# EAGLE design rfid_ctl3_v2 (EAGLE 7.5.0)
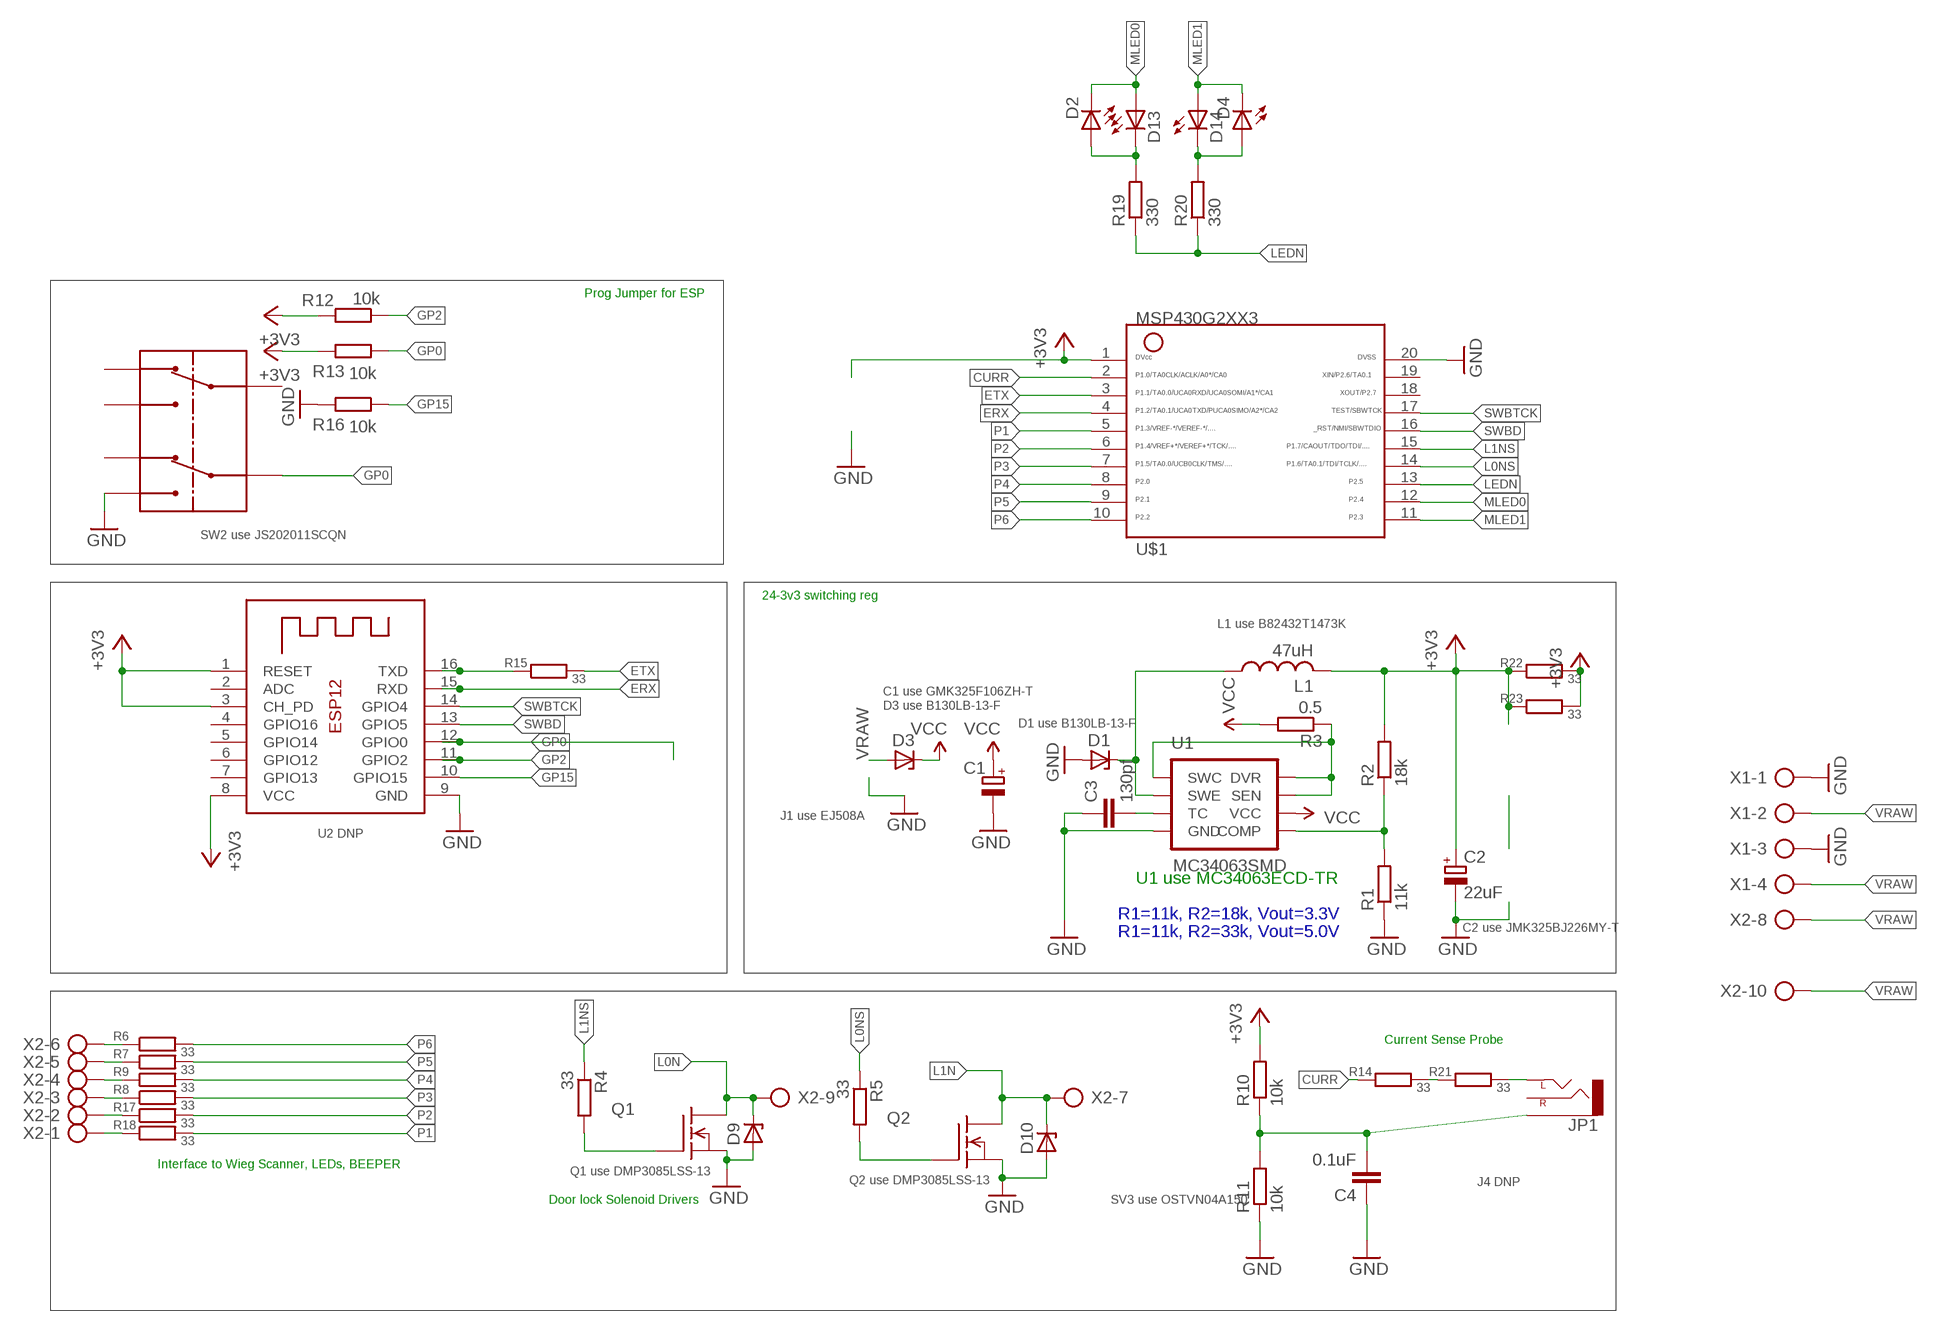
[diagram p0: schematic, sheet 1]

## Parts
C1  CPOL-EUE2.5-7  [E2,5-7]
C2  22uF  CPOL-EUE2.5-7  [E2,5-7]
C3  130pf  C-EUC1206  [C1206]
C4  0.1uF  C-EUC1206  [C1206]
D1  ZENER-DIODESMB  [SMB]
D2  LED5MM  [LED5MM]
D3  ZENER-DIODESMB  [SMB]
D4  LED5MM  [LED5MM]
D9  ZENER-DIODESMB  [SMB]
D10  ZENER-DIODESMB  [SMB]
D13  LED5MM  [LED5MM]
D14  LED5MM  [LED5MM]
JP1  AUDIO-JACKSMD2  [AUDIO-JACK-3.5MM-SMD]
L1  47uH  L-USL1812  [L1812]
Q1  FDS5680  [SO-8]
Q2  FDS5680  [SO-8]
R1  11k  R-EU_R1206  [R1206]
R2  18k  R-EU_R1206  [R1206]
R3  0.5  R-EU_R1206  [R1206]
R4  33  R-EU_R1206  [R1206]
R5  33  R-EU_R1206  [R1206]
R6  33  R-EU_R1206  [R1206]
R7  33  R-EU_R1206  [R1206]
R8  33  R-EU_R1206  [R1206]
R9  33  R-EU_R1206  [R1206]
R10  10k  R-EU_R1206  [R1206]
R11  10k  R-EU_R1206  [R1206]
R12  10k  R-EU_R1206  [R1206]
R13  10k  R-EU_R1206  [R1206]
R14  33  R-EU_R1206  [R1206]
R15  33  R-EU_R1206  [R1206]
R16  10k  R-EU_R1206  [R1206]
R17  33  R-EU_R1206  [R1206]
R18  33  R-EU_R1206  [R1206]
R19  330  R-EU_R1206  [R1206]
R20  330  R-EU_R1206  [R1206]
R21  33  R-EU_R1206  [R1206]
R22  33  R-EU_R6332  [R6332]
R23  33  R-EU_R6332  [R6332]
SW2  L202011MS02Q  [SMT]
U1  MC34063SMD  [SO08]
U2  ESP-12  [ESP-12]
U$1  G2XX3---N20  [N20]
X1  AK300/4  [AK300/4]
X2  AK300/10  [AK300/10]

## Nets
+3V3: C2.+ L1.2 R2.2 R10.2 R12.2 R13.2 R22.1 R22.2 R23.1 R23.2 U2.1(RESET) U2.3(CH_PD) U2.8(VCC) U$1.1
CURR: R14.1 U$1.2
ERX: U2.15(RXD) U$1.4
ETX: R15.2 U$1.3
GND: C1.- C2.- C3.1 C4.1 D1.A D9.A D10.A Q1.1(S) Q1.2(S) Q1.3(S) Q2.1(S) Q2.2(S) Q2.3(S) R1.1 R11.1 R16.2 SW2.B1 U1.4(GND) U2.9(GND) U$1.20 X1.1 X1.3
GP0: R13.1 SW2.B U2.12(GPIO0)
GP2: R12.1 U2.11(GPIO2)
GP15: R16.1 U2.10(GPIO15)
L0N: D9.C Q1.5(D) Q1.6(D) Q1.7(D) Q1.8(D) X2.9
L0NS: R5.1 U$1.14
L1N: D10.C Q2.5(D) Q2.6(D) Q2.7(D) Q2.8(D) X2.7
L1NS: R4.1 U$1.15
LEDN: R19.1 R20.1 U$1.13
MLED0: D2.K(C) D13.A U$1.12
MLED1: D4.K(C) D14.A U$1.11
N$1: Q1.4(G) R4.2
N$2: C3.2 U1.3(TC)
N$3: D1.C L1.1 U1.2(SWE)
N$4: Q2.4(G) R5.2
N$5: R1.2 R2.1 U1.5(COMP)
N$6: R3.1 U1.1(SWC) U1.7(SEN) U1.8(DVR)
N$7: R14.2 R21.1
N$8: R6.1 X2.6
N$9: R7.1 X2.5
N$10: R8.1 X2.4
N$11: R9.1 X2.3
N$12: C4.2 JP1.SLEEVE R10.1 R11.2
N$14: JP1.TIP(LEFT) R21.2
N$15: D2.A D13.K(C) R19.2
N$16: D4.A D14.K(C) R20.2
N$17: R17.1 X2.2
N$18: R18.1 X2.1
N$55: R15.1 U2.16(TXD)
P1: R18.2 U$1.5
P2: R17.2 U$1.6
P3: R9.2 U$1.7
P4: R8.2 U$1.8
P5: R7.2 U$1.9
P6: R6.2 U$1.10
SWBD: U2.13(GPIO5) U$1.16
SWBTCK: U2.14(GPIO4) U$1.17
VCC: C1.+ D3.C R3.2 U1.6(VCC)
VRAW: D3.A X1.2 X1.4 X2.8 X2.10
Unconnected: JP1.RING(RIGHT) SW2.A SW2.A1 SW2.A2 SW2.B2 U2.2(ADC) U2.4(GPIO16) U2.5(GPIO14) U2.6(GPIO12) U2.7(GPIO13) U$1.18 U$1.19

## Notes on the sheet
- Prog Jumper for ESP
- SW2 use JS202011SCQN
- 24-3v3 switching reg
- L1 use B82432T1473K
- C1 use GMK325F106ZH-T
- D3 use B130LB-13-F
- D1 use B130LB-13-F
- J1 use EJ508A
- U2 DNP
- U1 use MC34063ECD-TR
- R1=11k, R2=18k, Vout=3.3V
- C2 use JMK325BJ226MY-T
- R1=11k, R2=33k, Vout=5.0V
- Current Sense Probe
- Interface to Wieg Scanner, LEDs, BEEPER
- Q1 use DMP3085LSS-13
- Q2 use DMP3085LSS-13 | J4 DNP
- Door lock Solenoid Drivers | SV3 use OSTVN04A150

## Library data of the parts
C1 C2 = rcl:CPOL-EU: POLARIZED CAPACITOR, European symbol
C3 C4 = rcl:C-EU: CAPACITOR, European symbol
D1 D3 D9 D10 = diode:ZENER-DIODE: Z-Diode
D2 D4 D13 D14 = adafruit:LED: LED OSRAM: - CHIPLED LG R971, LG N971, LY N971, LG Q971, LY Q971, LO R971, LY R971 LH N974, LH R974 LS Q976, LO Q976, LY Q976 LO Q996 - Hyper CHIPLED LW Q18S LB Q993, LB Q99A, LB R99A - SideLED LS A670, LO A670, LY A670, LG A670, LP A670 LB A673, LV A673, LT A673, LW A673 LH A674 LY A675 LS A676, LA A676, LO A676, LY A676, LW A676 LS A679, LY A679, LG A679 - Hyper Micro SIDELED® LS Y876, LA Y876, LO Y876, LY Y876 LT Y87S - SmartLED LW L88C, LW L88S LB L89C, LB L89S, LG L890 LS L89K, LO L89K, LY L89K LS L896, LA L896, LO L896, LY L896 - TOPLED LS T670, LO T670, LY T670, LG T670, LP T670 LSG T670, LSP T670, LSY T670, LOP T670, LYG T670 LG T671, LOG T671, LSG T671 LB T673, LV T673, LT T673, LW T673 LH T674 LS T676, LA T676, LO T676, LY T676, LB T676, LH T676, LSB T676, LW T676 LB T67C, LV T67C, LT T67C, LS T67K, LO T67K, LY T67K, LW E67C LS E67B, LA E67B, LO E67B, LY E67B, LB E67C, LV E67C, LT E67C LW T67C LS T679, LY T679, LG T679 LS T770, LO T770, LY T770, LG T770, LP T770 LB T773, LV T773, LT T773, LW T773 LH T774 LS E675, LA E675, LY E675, LS T675 LS T776, LA T776, LO T776, LY T776, LB T776 LHGB T686 LT T68C, LB T68C - Hyper Mini TOPLED® LB M676 - Mini TOPLED Santana® LG M470 LS M47K, LO M47K, LY M47K Source: http://www.osram.convergy.de/
JP1 = SparkFun-Connectors:AUDIO-JACK: 3.5mm Audio Jack Simple 3.5mm common PCB mount audio jack. SKU: PRT-08032; PROD_ID: CONN-10353
L1 = rcl:L-US: INDUCTOR, American symbol
Q1 Q2 = transistor-fet:FDS5680: 60V N-Channel PowerTrench TM MOSFET FAIRCHILD FDS5680.pdf
R1-R23 = rcl:R-EU_: RESISTOR, European symbol
SW2 = JS202011SCQNC&K:L202011MS02Q
U1 = SparkFun:MC34063
U2 = adafruit:ESP-12
U$1 = TI_MSP430_v16:G2XX3---N20: MSP430G2XX1 PDIP (N) 20 Pin Package
X1 = con-ptr500:AK300/4: CONNECTOR; OC_FARNELL: unknown; OC_NEWARK: unknown
X2 = con-ptr500:AK300/10: CONNECTOR; OC_FARNELL: unknown; OC_NEWARK: unknown

## Board
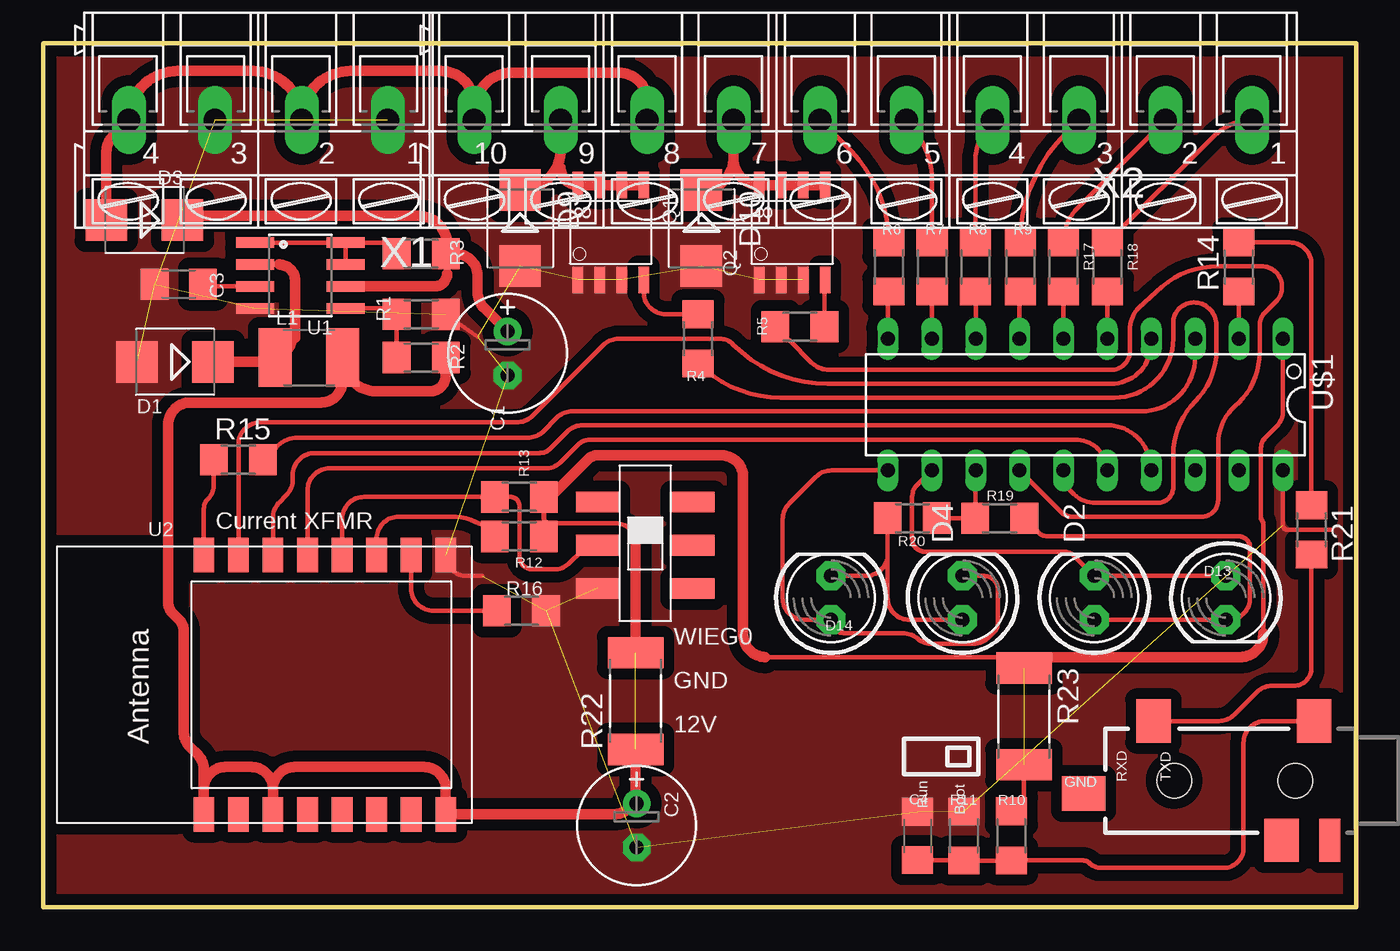
[diagram p1: board, top side]

Size 76 x 50 mm. Coordinates in mm from the lower left corner, seen from the top.
Outline: 0,0 76,0 76,50 0,50 0,0
Copper layers (1*16): Top 0.0356mm / dielectric 1.5011mm / Bottom 0.0356mm
Design rules "LaenPCBOrder *": minimum track width 6mil, minimum drill 13mil, track to track 16mil, track to pad 16mil, pad to pad 6mil, via to via 6mil, smd to smd 6mil, copper to edge 15mil, drill to drill 6mil, minimum pad ring 7mil, minimum via ring 7mil, stop-mask expansion 3mil, vias tented up to drill 30mil, thermal gap 10mil

### Footprints (pad centres in the part's own frame; a part is rotated, then mirrored left to right if it is on the bottom)
E2,5-7 = drill 0.813 pad 1.6: + -1.27,0 | drill 0.813 pad 1.6 octagon: - 1.27,0
C1206 = smd 1.6 x 1.8: 1 -1.4,0; 2 1.4,0
SMB = smd 2.4 x 2.4: A 2.2,0; C -2.2,0
LED5MM = drill 0.813 pad 1.676 octagon: A -1.27,0; K 1.27,0
AUDIO-JACK-3.5MM-SMD = smd 2 x 2.5: RING 4.3,3.45; SLEEVE 2.4,-3.45; TIP 11.7,-3.45 | smd 1.2 x 2.5: RSH 1.5,3.45 | smd 2.5 x 2: TSH 15.75,0.75 | hole 2: 3.5,0; 10.5,0
L1812 = smd 1.9 x 3.4: 1 -1.95,0; 2 1.95,0
SO-8 = smd 1.524 x 0.61: 1 -2.743,1.905; 2 -2.743,0.635; 3 -2.743,-0.635; 4 -2.743,-1.905; 5 2.743,-1.905; 6 2.743,-0.635; 7 2.743,0.635; 8 2.743,1.905
R1206 = smd 1.6 x 1.803: 1 -1.422,0; 2 1.422,0
R6332 = smd 1.8 x 3.2: 1 -2.8,0; 2 2.8,0
SMT = smd 1.2 x 2.5: A 3.1,1.3; A1 0.6,1.3; A2 5.6,1.3; B 3.1,6.8; B1 0.6,6.8; B2 5.6,6.8
SO08 = smd 0.61 x 2.21: 1 -1.905,-2.616; 2 -0.635,-2.616; 3 0.635,-2.616; 4 1.905,-2.616; 5 1.905,2.616; 6 0.635,2.616; 7 -0.635,2.616; 8 -1.905,2.616
ESP-12 = smd 2 x 1.2: 1 -7.5,4.5; 2 -7.5,2.5; 3 -7.5,0.5; 4 -7.5,-1.5; 5 -7.5,-3.5; 6 -7.5,-5.5; 7 -7.5,-7.5; 8 -7.5,-9.5; 9 7.5,-9.5; 10 7.5,-7.5; 11 7.5,-5.5; 12 7.5,-3.5; 13 7.5,-1.5; 14 7.5,0.5; 15 7.5,2.5; 16 7.5,4.5
N20 = drill 0.813 long: 1 -11.435,-3.81; 2 -8.895,-3.81; 3 -6.355,-3.81; 4 -3.815,-3.81; 5 -1.275,-3.81; 6 1.265,-3.81; 7 3.805,-3.81; 8 6.345,-3.81; 9 8.885,-3.81; 10 11.425,-3.81; 11 11.425,3.81; 12 8.885,3.81; 13 6.345,3.81; 14 3.805,3.81; 15 1.265,3.81; 16 -1.275,3.81; 17 -3.815,3.81; 18 -6.355,3.81; 19 -8.895,3.81; 20 -11.435,3.81
AK300/4 = drill 1.321 long: 1 -7.493,0; 2 -2.515,0; 3 2.515,0; 4 7.493,0
AK300/10 = drill 1.321 long: 1 -22.504,0; 2 -17.501,0; 3 -12.497,0; 4 -7.493,0; 5 -2.515,0; 6 2.489,0; 7 7.493,0; 8 12.497,0; 9 17.501,0; 10 22.504,0

### Placement (x,y rotation side)
C1  26.88,32.05 270 top
C2  34.35,4.74 270 top
C3  7.85,36.06 0 top
C4  50.61,4.13 270 top
D1  7.63,31.56 180 top
D2  60.83,17.91 90 top
D3  5.86,39.77 180 top
D4  53.21,17.91 90 top
D9  27.6,39.3 270 top
D10  38.1,39.3 270 top
D13  68.45,17.91 270 top
D14  45.59,17.91 90 top
JP1  75.96,7.33 180 top
L1  15.38,31.81 0 top
Q1  32.85,39.05 90 top
Q2  43.35,39.05 90 top
R1  21.88,34.31 180 top
R2  21.88,31.81 0 top
R3  21.88,37.81 0 top
R4  37.9,32.9 90 top
R5  43.8,33.6 0 top
R6  48.95,37.05 270 top
R7  51.45,37.05 270 top
R8  53.95,37.05 270 top
R9  56.55,37.05 270 top
R10  56.04,4.14 90 top
R11  53.3,4.13 270 top
R12  27.56,21.46 0 top
R13  27.56,23.75 0 top
R14  69.2,37.05 90 top
R15  11.3,25.91 0 top
R16  27.68,17.16 0 top
R17  59.05,37.05 270 top
R18  61.6,37.05 270 top
R19  55.37,22.52 0 top
R20  50.3,22.53 180 top
R21  73.41,21.84 270 top
R22  34.29,11.94 90 top
R23  56.77,11.05 270 top
SW2  38.9,17.86 90 top
U1  14.88,36.56 270 top
U2  13.8,12.88 90 top
U$1  60.32,29.09 180 top
X1  12.45,45.55 180 top
X2  47.45,45.55 180 top

### Tracks (layer width: path | path; a pad name or v marks a point on that pad's centre or on a via)
+3V3  (2 unrouted)
  Top 0.254: R2.2 23.3,30.78 | L1.2 17.33,30.48 | R12.2 R13.2 | R13.2 arc45 29.59,24 | 41.78,14.48 57.15,14.48 | 57.15,14.48 58.17,14.48 arc-90 58.2,14.57 | U$1.1 71.75,28.71 arc-45 71.38,27.82 70.71,27.15 arc45 70.48,26.61 70.48,22.53 70.61,22.23 70.61,15.88 | R13.2 28.96,22.61 arc90 29.34,22.23 33.15,22.23 arc-90 34.29,21.08 | R23.2 56.77,6.3 arc-90 R10.2 | R23.1 57.1,14.18 arc45 57.15,14.48 | 34.29,6.65 arc-90 34.35,6.6
  Top 0.61: 23.3,30.78 arc-90 22.38,29.86 19.28,29.86 arc-90 L1.2 | 13.3,6.86 arc90 12.03,8.13 10.57,8.13 arc90 9.3,6.86 U2.1 9.3,7.95 arc45 8.93,8.85 8.5,9.28 arc-45 8.13,10.18 8.13,16.07 arc45 7.91,16.61 7.46,17.05 arc-45 7.24,17.59 7.24,27.94 arc-90 8.51,29.21 16.06,29.21 arc90 17.33,30.48 | U2.3 13.3,6.86 | 13.3,6.86 arc-90 14.57,8.13 22.03,8.13 arc-90 23.3,6.86 U2.8 33.02,5.38 arc90 34.29,6.65 R22.1 | 29.59,24 31.5,25.91 arc-45 32.11,26.16 39.24,26.16 arc-90 40.51,24.89 40.51,15.88 arc90 41.78,14.48 | 58.17,14.48 69.34,14.48 arc90 70.61,15.88 | 34.29,21.08 R22.2 | 34.35,6.6 C2.+
CURR
  Top 0.254: R14.1 69.2,32.91 arc90 U$1.2
ERX
  Top 0.254: U$1.4 64.13,32.63 arc-90 61.8,30.3 45.4,30.3 arc-45 39.94,32.56 39.9,32.6 arc45 39.18,32.9 33.3,32.9 arc45 32.4,32.53 28.31,28.44 arc-45 27.41,28.07 12.57,28.07 arc90 11.3,26.8 U2.15
ETX
  Top 0.254: U$1.3 66.67,31.82 arc-90 63.55,28.7 30.62,28.7 arc45 29.73,28.33 28.95,27.55 arc-45 28.05,27.18 14.73,27.18 arc98 13.08,25.27 arc-90 12.72,25.63 R15.2
GND  (21 unrouted)
  Top 0.254: U$1.20 71.75,22.1 arc90 72.01,21.84 74.55,21.84 | R1.1 25.15,33.02 | U2.9 arc90 24.51,19.18 25.4,19.18
  pour Top (isolate 0.635, no thermals): -3.17,52.7 79.25,52.7 arc-90 80.52,51.44 80.52,-2.29 -1.02,-2.29 arc-90 -2.29,-1.02 -2.29,47.75
GP0
  Top 0.254: U2.12 17.3,22.48 arc-90 18.57,23.75 R13.1 27.05,23.75 arc-90 27.56,23.24 27.56,20.32 arc90 28.32,19.56 29.57,19.56 arc45 30.47,19.93 31.13,20.59 arc-45 32.02,20.96 SW2.B
GP2
  Top 0.254: U2.11 19.3,21.34 arc-90 20.57,22.61 23.62,22.61 arc-51 R12.1
GP15
  Top 0.254: U2.10 21.3,18.43 arc90 22.57,17.16 R16.1
L0N
  Top 0.254: 29.95,42.79 X2.9
  Top 0.61: Q1.5 Q1.6 Q1.7 Q1.8 arc-90 29.95,42.79 | D9.C arc90 29.95,43.85 X2.9
L0NS
  Top 0.254: R5.1 43.16,32.82 arc45 43.2,32.8 44.48,31.52 arc45 45.5,31.1 61.8,31.1 arc90 62.9,32.2 62.9,33.42 arc-45 63.4,34.7 64.42,35.62 arc-45 68,37.1 70.5,37.1 arc-90 71.7,35.9 arc-45 71.35,35.05 70.68,34.38 arc45 70.4,33.7 70.4,32.1 arc-45 69.2,29.2 arc53 68,26.8 68,23.55 arc-90 67.06,22.61 59.5,22.61 arc-45 58.96,22.83 U$1.14
L1N
  Top 0.254: 39.96,43.36 X2.7
  Top 0.61: Q2.5 Q2.6 Q2.7 Q2.8 arc-90 39.96,43.28 X2.7 | D10.C arc90 39.96,43.36
L1NS
  Top 0.254: U$1.15 arc90 60.93,23.4 64.5,23.4 arc90 65.4,24.3 65.4,26.2 arc-45 66.67,29.27 arc45 67.9,32.24 67.9,33.7 arc90 66.6,35 arc90 65.4,33.8 65.4,32.9 arc-90 62,29.5 42.67,29.5 arc-45 R4.1
LEDN
  Top 0.254: U$1.13 arc90 53.94,25.25 R19.1 51.73,22.52 arc-90 R20.1
MLED0
  Top 0.254: U$1.12 50.57,24.42 arc45 50.29,23.75 50.29,21.34 arc90 51.05,20.57 59.12,20.57 arc-45 59.66,20.35 D2.K D13.A
MLED1
  Top 0.254: U$1.11 45.62,25.28 arc45 44.72,24.91 43.17,23.36 arc45 42.8,22.46 42.8,17.91 arc90 44.07,16.64 D14.A arc90 46.35,15.88 49.6,15.88 arc-45 50.67,15.49 50.55,15.61 arc45 51.45,15.24 53.83,15.24 arc45 54.85,15.74 55.02,15.91 arc45 55.24,16.45 55.24,18.41 arc90 54.48,19.18 D4.K
N$1
  Top 0.254: Q1.4 34.76,35.59 arc90 36.02,34.32 R4.2
N$2
  Top 0.254: U1.3 9.39,35.93 arc-90 C3.2
N$3
  Top 0.254: 14.58,32.96 arc-90 L1.1 arc-90 13.18,31.56 | U1.2 13.65,37.2
  Top 0.61: 13.65,37.2 arc-90 14.58,36.26 14.58,32.96 | D1.C 13.18,31.56
N$4
  Top 0.254: R5.2 45.22,36.23 arc-45 Q2.4
N$5
  Top 0.254: U1.5 20.11,34.66 arc-90 R1.2 R2.1
N$6
  Top 0.254: U1.8 19.8,38.47 arc-90 R3.1 | U1.7 U1.8 | U1.1 U1.8
N$7
  Top 0.254: R14.2 72.14,38.47 arc-90 73.41,37.2 R21.1
N$8
  Top 0.254: X2.6 46.77,43.74 arc-45 R6.1
N$9
  Top 0.254: X2.5 arc-45 51.45,41.96 R7.1
N$10
  Top 0.254: X2.4 arc45 53.95,43.15 R8.1
N$11
  Top 0.254: X2.3 59.15,44.76 arc45 R9.1
N$12
  Top 0.254: JP1.SLEEVE 70.74,10.78 arc90 69.47,9.51 69.47,3.43 arc-90 68.33,2.29 61.19,2.29 arc-45 60.58,2.54 arc45 60.14,2.72 R10.1 arc-90 56.03,2.71 R11.2 arc90 53.28,2.73 C4.2
N$14
  Top 0.254: JP1.TIP 68.04,10.78 arc45 68.94,11.15 70.24,12.46 arc-45 71.14,12.83 72.39,12.83 arc90 73.41,13.84 R21.2
N$15
  Top 0.254: D2.A D13.K 68.58,16.64 arc90 69.85,17.91 69.85,20.83 arc90 69.22,21.46 58.16,21.46 arc-45 57.62,21.69 R19.2
N$16
  Top 0.254: D14.K 47.61,19.18 arc90 48.88,20.45 R20.2 48.88,17.91 arc90 50.15,16.64 D4.A
N$17
  Top 0.254: X2.2 59.88,40.48 arc45 R17.1
N$18
  Top 0.254: R18.1 67.78,44.65 arc-45 X2.1
N$55
  Top 0.254: R15.1 9.88,24.48 arc-45 9.53,23.62 arc45 9.3,23.08 U2.16
P1
  Top 0.254: R18.2 61.59,35.62 U$1.5
P2
  Top 0.254: R17.2 | R17.2 U$1.6
P3
  Top 0.254: R9.2 56.51,35.59 U$1.7
P4
  Top 0.254: R8.2 53.97,35.61 U$1.8
P5
  Top 0.254: R7.2 51.43,35.61 U$1.9
P6
  Top 0.254: R6.2 48.89,35.57 U$1.10
SWBD
  Top 0.254: U$1.16 arc90 59.72,27.05 38.74,27.05 arc-45 38.73,27.05 31.6,27.05 arc45 30.99,26.8 29.96,25.77 arc-45 29.07,25.4 16.57,25.4 arc90 15.3,24.13 U2.13
SWBTCK
  Top 0.254: U$1.17 arc90 61.61,27.9 31.22,27.9 arc45 30.32,27.53 29.34,26.54 arc-45 28.72,26.29 15.71,26.29 arc90 14.44,25.02 14.44,24.75 arc-45 14.07,23.85 13.67,23.45 arc45 13.3,22.55 U2.14
VCC
  Top 0.254: 23.38,36.66 23.38,37.73 arc90 R3.2 23.88,37.81 | D3.C arc-45 8.64,40.01
  Top 0.61: U1.6 22.65,35.93 arc90 23.38,36.66 | 8.64,40.01 21.72,40.01 arc-108 R3.2 | C1.+ 25.52,34.68 arc-45 25.15,35.58 25.15,36.54 arc90 23.88,37.81
VRAW
  Top 0.254: 24.95,46.45 24.95,46.1
  Top 0.61: 24.95,46.45 arc90 23,48.4 17.82,48.4 arc90 X1.2 arc90 12.12,48.4 7.81,48.4 arc90 X1.4 4.03,44.62 arc45 3.66,43.73 D3.A | X2.10 24.95,46.1 arc-90 27.15,48.3 33.3,48.3 arc-90 34.95,46.65 X2.8

### Text on the board
tPlace: Current XFMR | Technocopia / Networked Keycard / Access System / Rev B Alex Camilo | WIEG0 | GND | 12V | GND | RXD | TXD | Run | Boot